# Altium schematic sheet Processor.SchDoc
size A4; SheetNumber: 2; SheetTotal: 5
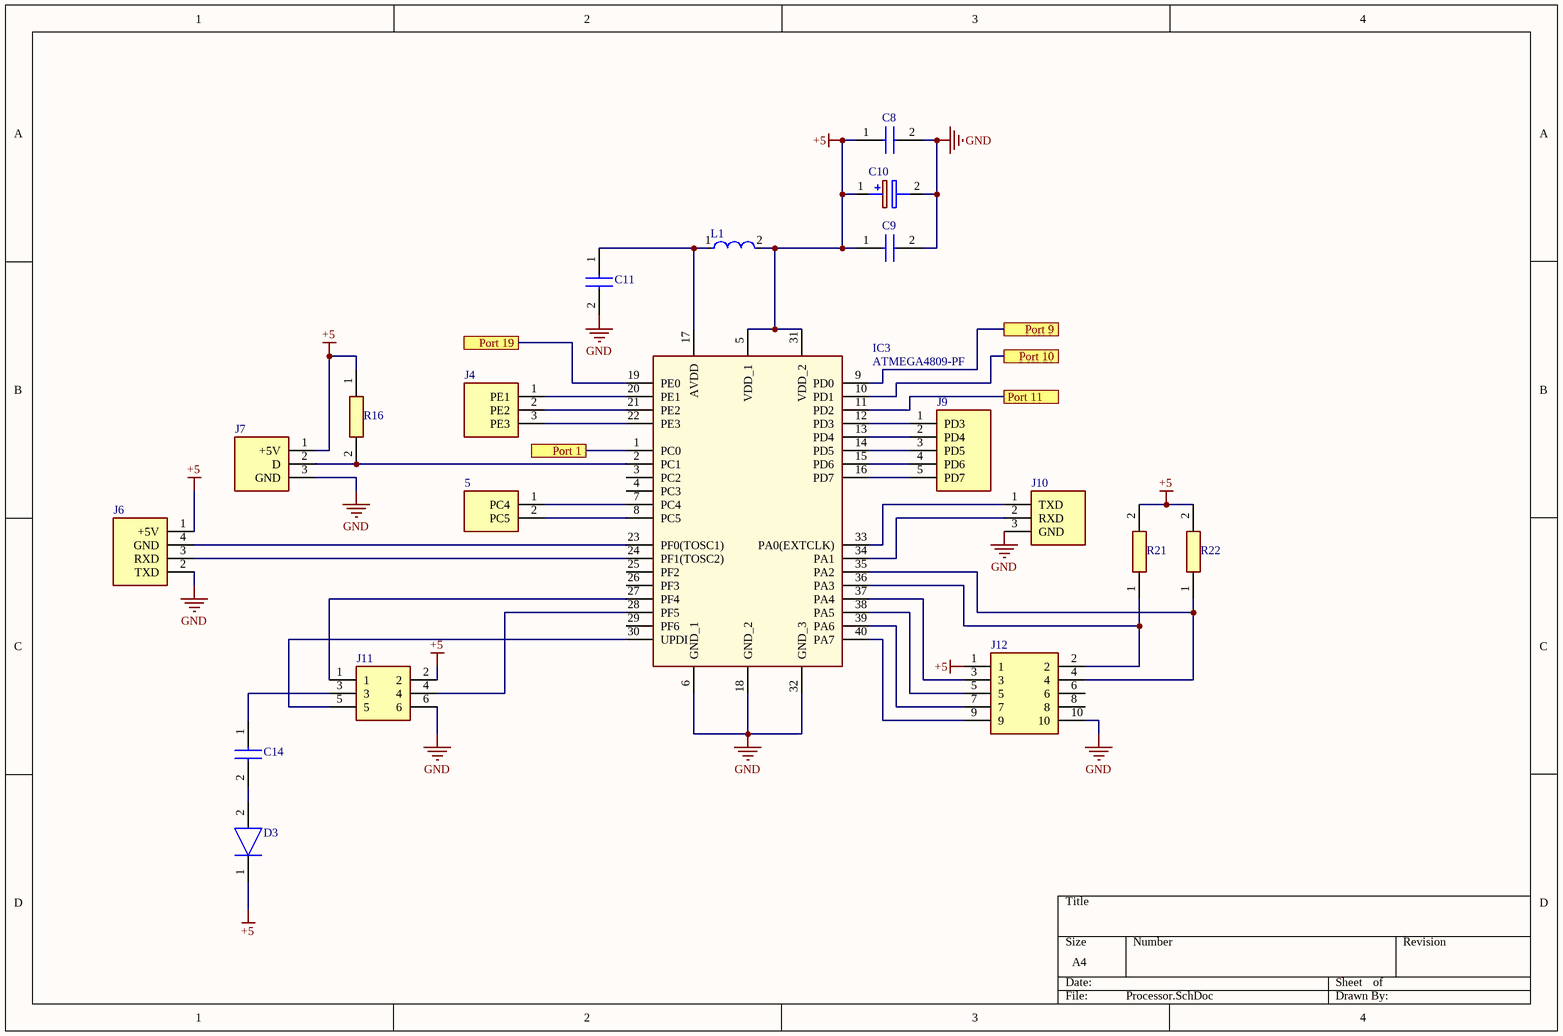
[diagram p0: Processor.SchDoc]

## Parts
5  1711725  [1711725]  (value not drawn)
C8  C0805C104K5RAC7411  [100nF]  (value not drawn)
C9  C0805C104K5RAC7411  [100nF]  (value not drawn)
C10  EEU-FR1H100  [10µF 50V]  (value not drawn)
C11  C0805C104K5RAC7411  [100nF]  (value not drawn)
C14  C0805C104K5RAC7411  [100nF]  (value not drawn)
D3  1N4148WS_R1_00001  [SODFL2512X95N]  (value not drawn)
IC3  ATMEGA4809-PF  [DIP1543W58P254L5175H635Q40N]
J4  10129378-903001BLF  [HDRV3W67P0X254_1X3_762X241X858P]  (value not drawn)
J6  10129378-904001BLF  [HDRV4W67P0X254_1X4_1270X241X858P]  (value not drawn)
J7  10129378-903001BLF  [HDRV3W67P0X254_1X3_762X241X858P]  (value not drawn)
J9  10129378-905001BLF  [HDRV5W67P0X254_1X5_1270X241X858P]  (value not drawn)
J10  10129378-903001BLF  [HDRV3W67P0X254_1X3_762X241X858P]  (value not drawn)
J11  10129381-906002BLF  [HDRV6W67P254_2X3_762X483X858P]  (value not drawn)
J12  N2510-6002RB  [1PinBox]  (value not drawn)
L1  CBC3225T100MR  [FP-CB3225-IPC_A]  (value not drawn)
R16  CRCW08054K70FKEAHP  [RESC2012X50N]  (value not drawn)
R21  CRCW08054K70FKEAHP  [RESC2012X50N]  (value not drawn)
R22  CRCW08054K70FKEAHP  [RESC2012X50N]  (value not drawn)

## Ports
Port 1, Port 9, Port 10, Port 11, Port 19

## Nets
+5: C8.1 C9.1 C10.1(+) D3.1(K) IC3.5(VDD_1) IC3.31(VDD_2) J6.1(+5V) J7.1(+5V) J11.2 J12.1 L1.2 R16.1 R21.2 R22.2
GND: C8.2 C9.2 C10.2(-) C11.2 IC3.6(GND_1) IC3.18(GND_2) IC3.32(GND_3) J6.2(TXD) J7.3(GND) J10.3(GND) J11.6 J12.10
Port 1: IC3.1(PC0) ; port Port 1
Port 9: IC3.9(PD0) ; port Port 9
Port 10: IC3.10(PD1) ; port Port 10
Port 11: IC3.11(PD2) ; port Port 11
Port 19: IC3.19(PE0) ; port Port 19
Net5_1: 5.1(PC4) IC3.7(PC4)
Net5_2: 5.2(PC5) IC3.8(PC5)
NetC11_1: C11.1 IC3.17(AVDD) L1.1
NetC14_1: C14.1 J11.3
NetC14_2: C14.2 D3.2(A)
NetIC3_2: IC3.2(PC1) J7.2(D) R16.2
NetIC3_12: IC3.12(PD3) J9.1(PD3)
NetIC3_13: IC3.13(PD4) J9.2(PD4)
NetIC3_14: IC3.14(PD5) J9.3(PD5)
NetIC3_15: IC3.15(PD6) J9.4(PD6)
NetIC3_16: IC3.16(PD7) J9.5(PD7)
NetIC3_20: IC3.20(PE1) J4.1(PE1)
NetIC3_21: IC3.21(PE2) J4.2(PE2)
NetIC3_22: IC3.22(PE3) J4.3(PE3)
NetIC3_23: IC3.23(PF0(TOSC1)) J6.4(GND)
NetIC3_24: IC3.24(PF1(TOSC2)) J6.3(RXD)
NetIC3_27: IC3.27(PF4) J11.1
NetIC3_28: IC3.28(PF5) J11.4
NetIC3_30: IC3.30(UPDI) J11.5
NetIC3_33: IC3.33(PA0(EXTCLK)) J10.1(TXD)
NetIC3_34: IC3.34(PA1) J10.2(RXD)
NetIC3_35: IC3.35(PA2) J12.4 R22.1
NetIC3_36: IC3.36(PA3) J12.2 R21.1
NetIC3_37: IC3.37(PA4) J12.3
NetIC3_38: IC3.38(PA5) J12.5
NetIC3_39: IC3.39(PA6) J12.7
NetIC3_40: IC3.40(PA7) J12.9

Not connected (* = marked no-connect by the designer): IC3 3(PC2) 4(PC3) 25(PF2) 26(PF3) 29(PF6); J12 6 8

## Library data of the parts
5 = 1711725: Connector; Manufacturer_Name: Phoenix Contact; Datasheet Link: http://www.phoenixcontact.com/de/produkte/1711725/pdf; Height: 18.2mm; Manufacturer_Part_Number: 1711725
C8 C9 C11 C14 = C0805C104K5RAC7411: Capacitor  0.1 uF 50VDC; Manufacturer_Name: Kemet; Datasheet Link: https://componentsearchengine.com//C0805C104K5RAC7411.pdf; Height: 0.88mm; Mouser2 Part Number: 80-C0805C104K5RACLR; Mouser2 Price/Stock: https://www.mouser.com/Search/Refine.aspx?Keyword=80-C0805C104K5RACLR; Manufacturer_Part_Number: C0805C104K5RAC7411
C10 = EEU-FR1H100: Capacitor Polarised 50VDC 10uF; Manufacturer_Name: Panasonic; Datasheet Link: https://componentsearchengine.com//EEU-FR1H100.pdf; Height: 12.5mm; Mouser2 Part Number: 667-EEU-FR1H100; Mouser2 Price/Stock: https://www.mouser.com/Search/Refine.aspx?Keyword=667-EEU-FR1H100; Manufacturer_Part_Number: EEU-FR1H100
D3 = 1N4148WS_R1_00001: Diode; Manufacturer_Name: PANJIT; Datasheet Link: https://www.mouser.it/datasheet/2/1057/1N4148WS-1869723.pdf; Height: 0.95mm; Manufacturer_Part_Number: 1N4148WS_R1_00001
IC3 = ATMEGA4809-PF: Integrated Circuit; Manufacturer_Name: Microchip; Datasheet Link: https://componentsearchengine.com//ATMEGA4809-PF.pdf; Height: 6.35mm; Mouser2 Part Number: 556-ATMEGA4809-PF; Mouser2 Price/Stock: https://www.mouser.com/Search/Refine.aspx?Keyword=556-ATMEGA4809-PF; Manufacturer_Part_Number: ATMEGA4809-PF
J4 J7 J10 = 10129378-903001BLF: Connector; Manufacturer_Name: Amphenol; Height: 8.58mm; Manufacturer_Part_Number: 10129378-903001BLF
J6 = 10129378-904001BLF: Connector; Manufacturer_Name: Amphenol; Datasheet Link: https://cdn.amphenol-icc.com/media/wysiwyg/files/drawing/10129378.pdf; Height: 8.58mm; Manufacturer_Part_Number: 10129378-904001BLF
J9 = 10129378-905001BLF: Connector; Manufacturer_Name: FCI Electronics; Datasheet Link: https://cdn.amphenol-icc.com/media/wysiwyg/files/drawing/10129378.pdf; Height: 8.58mm; Manufacturer_Part_Number: 10129378-905001BLF
J11 = 10129381-906002BLF: Connector; Manufacturer_Name: Amphenol; Datasheet Link: https://componentsearchengine.com//10129381-906002BLF.pdf; Height: 8.58mm; Mouser2 Part Number: 649-1012938190602BLF; Mouser2 Price/Stock: https://www.mouser.com/Search/Refine.aspx?Keyword=649-1012938190602BLF; Manufacturer_Part_Number: 10129381-906002BLF
J12 = N2510-6002RB: Connector; Manufacturer_Name: 3M; Datasheet Link: https://componentsearchengine.com//N2510-6002RB.pdf; Height: 9.91mm; Mouser2 Part Number: 517-N2510-6002RB; Mouser2 Price/Stock: https://www.mouser.com/Search/Refine.aspx?Keyword=517-N2510-6002RB; Manufacturer_Part_Number: N2510-6002RB
L1 = CMP-14484-000123-1: SMD Inductors 10uH ±20% 0.9A 0.1729Ω 1210; Shielding: Unshielded; DC Resistance (DCR): 172.9mR; Core Material: Ferrite; Self Resonant Frequency: 23MHz; Max DC Current: 900mA; Test Frequency: 100kHz; Package Quantity: 1000; Military Standard: Not; Inductance: 10uH; Height: 2.5mm; Case Code (Metric): 3225; Width: 0.098inch; Case Code (Imperial): 1210; Inductance Tolerance: 20%; Lead Free: Lead Free; Length: 3.4mm; Max Operating Temperature: 105°C; Resistor Type: Wirewound; Height - Seated (Max): 0.106inch; Series: CB; Packaging: Tape and Reel; Depth: 2.7mm; Number of Pins: 2; Radiation Hardening: No; Tolerance: 20%; Case/Package: 1210; Mount: Surface Mount; Saturation Current: 900mA; Min Operating Temperature: -40°C; DC Current: 900mA; Current Rating: 900mA; Halogen Free: Halogen Free; Termination: SMD/SMT
R16 R21 R22 = CRCW08054K70FKEAHP: Resistor 4.7KOhm; Manufacturer_Name: Vishay; Datasheet Link: https://componentsearchengine.com//CRCW08054K70FKEAHP.pdf; Height: 0.5mm; Mouser2 Part Number: 71-CRCW08054K70FKEAH; Mouser2 Price/Stock: https://www.mouser.com/Search/Refine.aspx?Keyword=71-CRCW08054K70FKEAH; Manufacturer_Part_Number: CRCW08054K70FKEAHP